# Altium schematic sheet InductiveSensor.SchDoc
size Letter
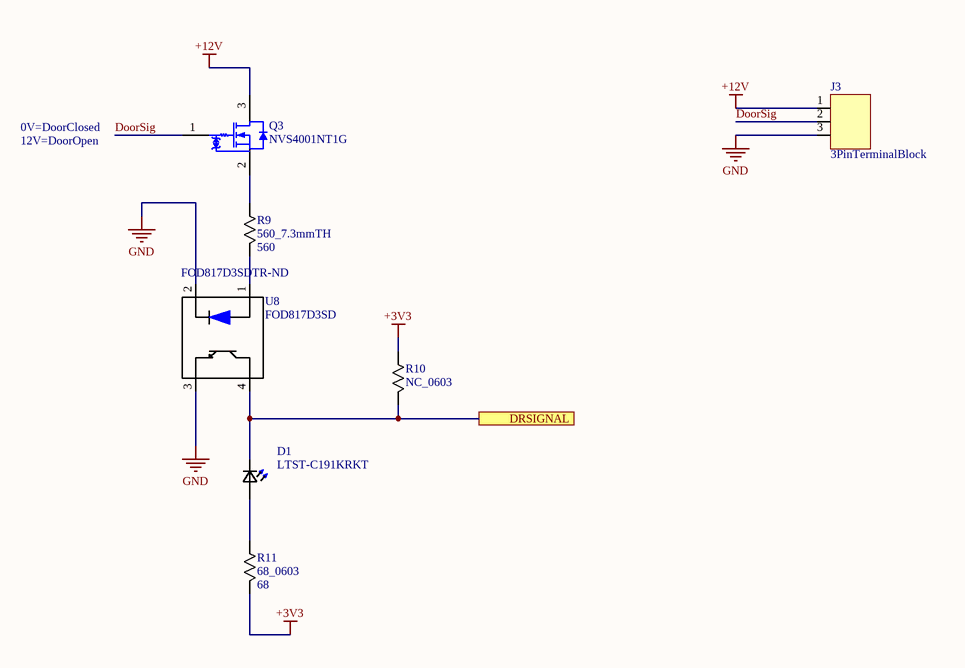
[diagram p0: InductiveSensor.SchDoc]

## Parts
D1  LTST-C191KRKT  [0603]
J3  3PinTerminalBlock  [3 POS 5mm Pitch]
Q3  NVS4001NT1G  [ONSC-SC-70-3-419-04_V]
R9  560_7.3mmTH  Resistance: 560  [7.3mm Through Hole]
R10  NC_0603  [0603]
R11  68_0603  Resistance: 68  [0603]
U8  FOD817D3SD  Supplier Part Number 1: FOD817D3SDTR-ND  [FOD817D3SD]

## Ports
DRSIGNAL

## Nets
+3V3: R10.2 R11.1
+12V: J3.1 Q3.3(D)
GND: J3.3 U8.2(CATHODE) U8.3(EMITER)
DoorSig: J3.2 Q3.1(G)
DRSIGNAL: D1.1(K2) R10.1 U8.4(COLLECTOR) ; port DRSIGNAL
NetD1_2: D1.2(A2) R11.2
NetQ3_2: Q3.2(S) R9.2
NetR9_1: R9.1 U8.1(ANODE)

## Notes on the sheet
- 0V=DoorClosed
- 12V=DoorOpen

## Library data of the parts
D1 = LTST-C191KRKT: LED; SMD; 0603; red; 18-54mcd; 1.6x0.8x0.55mm; 130Â°; 2Ã·2.4V; 20mA; MF: Lite-On; Package: 0603 Lite-On; MP: LTST-C191KRKT; SnapEDA_Link: https://www.snapeda.com/parts/LTST-C191KRKT/Lite-On/view-part/?ref=snap; Availability: Good; Price: 0.06 USD; Value: *
J3 = 3PinTerminalBlock: 3 Position terminal block
Q3 = NVS4001NT1G: Small Signal MOSFET, 30 V, 270 mA, N-Channel, 3-Pin SC70, Pb-Free, Tape and Reel; Manufacturer: On Semiconductor; Channel Polarity: N Channel; Ciss Typ (pF): 20; Configuration: Single; Coss Typ (pF): 19; Crss Typ (pF): 7.25; ID Max (A): 0.27; PD Max (W): 0.33; V(BR)DSS Min (V): 30; VGS(th) Max (V): 1.5; DatasheetVersion: Rev. 5; PackageVersion: Rev. N, 11/2008; PackageReference: SC-70-3-419-04; PackageDescription: 3-Pin Small Outline Transistor, Body 2 x 1.25 mm, Pitch 0.65 mm; Supplier 1: Newark; Supplier Part Number 1: 60W1862; Supplier 2: Mouser; Supplier Part Number 2: 863-NVS4001NT1G; Package Type: SC-70-3; Packing: Tape and Reel; RoHS: Pb-Free; VGS Max (V): 20; Mounting Technology: Surface Mount; PartNumber: NVS4001NT1G; ComponentLink1Description: Manufacturer URL; ComponentLink1URL: http://www.onsemi.com/; ComponentLink2Description: Datasheet; ComponentLink2URL: http://www.onsemi.cn/pub_link/Collateral/NTS4001N-D.PDF; ComponentLink3Description: Package Specification; ComponentLink3URL: http://www.onsemi.cn/pub_link/Collateral/419-04.PDF
R9 = 560_7.3mmTH: Manufacturer: Stackpole Electronics; Manufacturer Part Number: CFM12JT560R; Tolerance: 5%; Temperature Coefficient: -400ppm/°C; Max Power Dissipation: 500mW; Supplier 1: Digi-Key; Stock 1: 0; Pricing 1: 5000=0.00703, 10000=0.00611, 25000=0.00537, 50000=0.00492, 125000=0.00482 (USD); Mount: Through Hole,Axial; Case/Package: Axial; Contact Plating: Tin,Matte; Min Operating Temperature: -55°C; Max Operating Temperature: 155°C; Package Quantity: 5000; Packaging: Tape and Reel; Composition: Carbon Film; Number of Terminations: 2; Diameter: 2.3mm; Length: 0.256inch; Radiation Hardening: No; Lead Free: Lead Free; ComponentLink1URL: https://www.seielect.com/Catalog/SEI-CF_CFM.pdf; ComponentLink1Description: https://www.seielect.com/Catalog/SEI-CF_CFM.pdf; Supplier Part Number 1: S560HTR-ND
R10 = NC_0603: Resistance: NC
R11 = 68_0603: Manufacturer: Vishay; Manufacturer Part Number: CRCW060368R0FKEA; Tolerance: 1%; Power Rating: 100mW; Voltage Rating: 75V; Temperature Coefficient: 100ppm/°C; Supplier 1: Digi-Key; Stock 1: 0; Pricing 1: 5000=0.00497, 10000=0.00432, 25000=0.00405 (USD); Case/Package: 0603; Weight: 7.1E-05oz; Case Code (Metric): 1608; Case Code (Imperial): 0603; Contact Plating: Tin; Min Operating Temperature: -55°C; Max Operating Temperature: 155°C; Composition: Thick Film; Packaging: Tape and Reel; Voltage Rating (DC): 75V; Package Quantity: 10; Number of Terminations: 2; Termination: SMD/SMT; Max Power Dissipation: 100mW; Military Standard: Not; Length: 1.55mm; Height: 0.45mm; Width: 0.033inch; Depth: 0.85mm; Radiation Hardening: No; REACH SVHC: Unknown; Lead Free: Lead Free; ComponentLink1URL: https://datasheet.ciiva.com/2494/dcrcwe3-2494368.pdf; ComponentLink1Description: https://datasheet.ciiva.com/2494/dcrcwe3-2494368.pdf; ComponentLink2URL: https://datasheet.ciiva.com/11809/0900766b80d98afc-11809013.pdf; ComponentLink2Description: https://datasheet.ciiva.com/11809/0900766b80d98afc-11809013.pdf; ComponentLink3URL: https://datasheet.ciiva.com/8337/dcrcwe3-8337350.pdf; ComponentLink3Description: https://datasheet.ciiva.com/8337/dcrcwe3-8337350.pdf; ComponentLink4URL: https://datasheet.ciiva.com/7777/1697337-7777608.pdf; ComponentLink4Description: https://datasheet.ciiva.com/7777/1697337-7777608.pdf; ComponentLink5URL: https://datasheet.ciiva.com/16770/70201119-16770904.pdf; ComponentLink5Description: https://datasheet.ciiva.com/16770/70201119-16770904.pdf; ComponentLink6URL: https://datasheet.ciiva.com/2494/dcrcwe3-2494366.pdf; ComponentLink6Description: https://datasheet.ciiva.com/2494/dcrcwe3-2494366.pdf; ComponentLink7URL: https://datasheet.ciiva.com/22870/70201119-22870302.pdf; ComponentLink7Description: https://datasheet.ciiva.com/22870/70201119-22870302.pdf; ComponentLink8URL: https://datasheet.ciiva.com/2494/dcrcwe3-2494367.pdf; ComponentLink8Description: https://datasheet.ciiva.com/2494/dcrcwe3-2494367.pdf; ComponentLink9URL: https://datasheet.ciiva.com/16200/dcrcw-16200591.pdf; ComponentLink9Description: https://datasheet.ciiva.com/16200/dcrcw-16200591.pdf; Supplier Part Number 1: 541-68.0HTR-ND
U8 = FOD817D3SD: OPTOISOLATOR 5KV TRANSISTOR 4SMD 20mA/1.2V saturation; Manufacturer: ON Semiconductor / Fairchild; Max Power Dissipation: 200mW; Collector Emitter Voltage (VCEO): 200mV; Max Input Current: 50mA; Rise Time: 18000ns; Number of Channels: 1; Forward Voltage: 1.4V; Reverse Breakdown Voltage: 6V; Output Voltage: 70V; Current Transfer Ratio: 600%; Supplier 1: Digi-Key; Manufacturer Part Number: FOD817D3SD; Stock 1: 123000; Pricing 1: 1000=0.15939, 2000=0.14611, 5000=0.13283, 10000=0.12397, 25000=0.11954, 50000=0.11512 (USD); Mount: Surface Mount; Case/Package: SMD/SMT; Number of Pins: 4; Weight: 0g; Min Operating Temperature: -55°C; Max Operating Temperature: 110°C; Collector Emitter Saturation Voltage: 200mV; Package Quantity: 1; Packaging: Tape and Reel; Forward Current: 50mA; Max Output Voltage: 70V; Output Current per Channel: 50mA; Max Collector Current: 50mA; Isolation Voltage: 5kV; Fall Time: 18000ns; Number of Elements: 1; Power Dissipation: 200mW; Input Current: 50mA; Number of Circuits: 1; Radiation Hardening: No; REACH SVHC: No SVHC; Lead Free: Lead Free; ComponentLink1URL: https://datasheet.ciiva.com/25620/0900766b810e24fa-25620565.pdf; ComponentLink1Description: https://datasheet.ciiva.com/25620/0900766b810e24fa-25620565.pdf; ComponentLink2URL: https://datasheet.ciiva.com/26122/fod817d-26122105.pdf; ComponentLink2Description: https://datasheet.ciiva.com/26122/fod817d-26122105.pdf; ComponentLink3URL: https://datasheet.ciiva.com/15118/getdatasheetpartid-67082-15118458.pdf; ComponentLink3Description: https://datasheet.ciiva.com/15118/getdatasheetpartid-67082-15118458.pdf; ComponentLink4URL: https://datasheet.ciiva.com/2086/fod817d-2086155.pdf; ComponentLink4Description: https://datasheet.ciiva.com/2086/fod817d-2086155.pdf; ComponentLink5URL: https://datasheet.ciiva.com/46433/1563587-46433595.pdf; ComponentLink5Description: https://datasheet.ciiva.com/46433/1563587-46433595.pdf; ComponentLink6URL: https://datasheet.ciiva.com/2086/fod817d-2086156.pdf; ComponentLink6Description: https://datasheet.ciiva.com/2086/fod817d-2086156.pdf; ComponentLink7URL: https://datasheet.ciiva.com/2086/fod817d-2086157.pdf; ComponentLink7Description: https://datasheet.ciiva.com/2086/fod817d-2086157.pdf; ComponentLink8URL: https://datasheet.ciiva.com/8095/fod817d-8095549.pdf; ComponentLink8Description: https://datasheet.ciiva.com/8095/fod817d-8095549.pdf; ComponentLink9URL: https://datasheet.ciiva.com/4701/fod817d-4701711.pdf; ComponentLink9Description: https://datasheet.ciiva.com/4701/fod817d-4701711.pdf; ComponentLink10URL: https://datasheet.ciiva.com/17001/fod817-17001647.pdf; ComponentLink10Description: https://datasheet.ciiva.com/17001/fod817-17001647.pdf